# EAGLE schematic USB to RS232 (EAGLE 5.06)

## Sheet 1 of 3
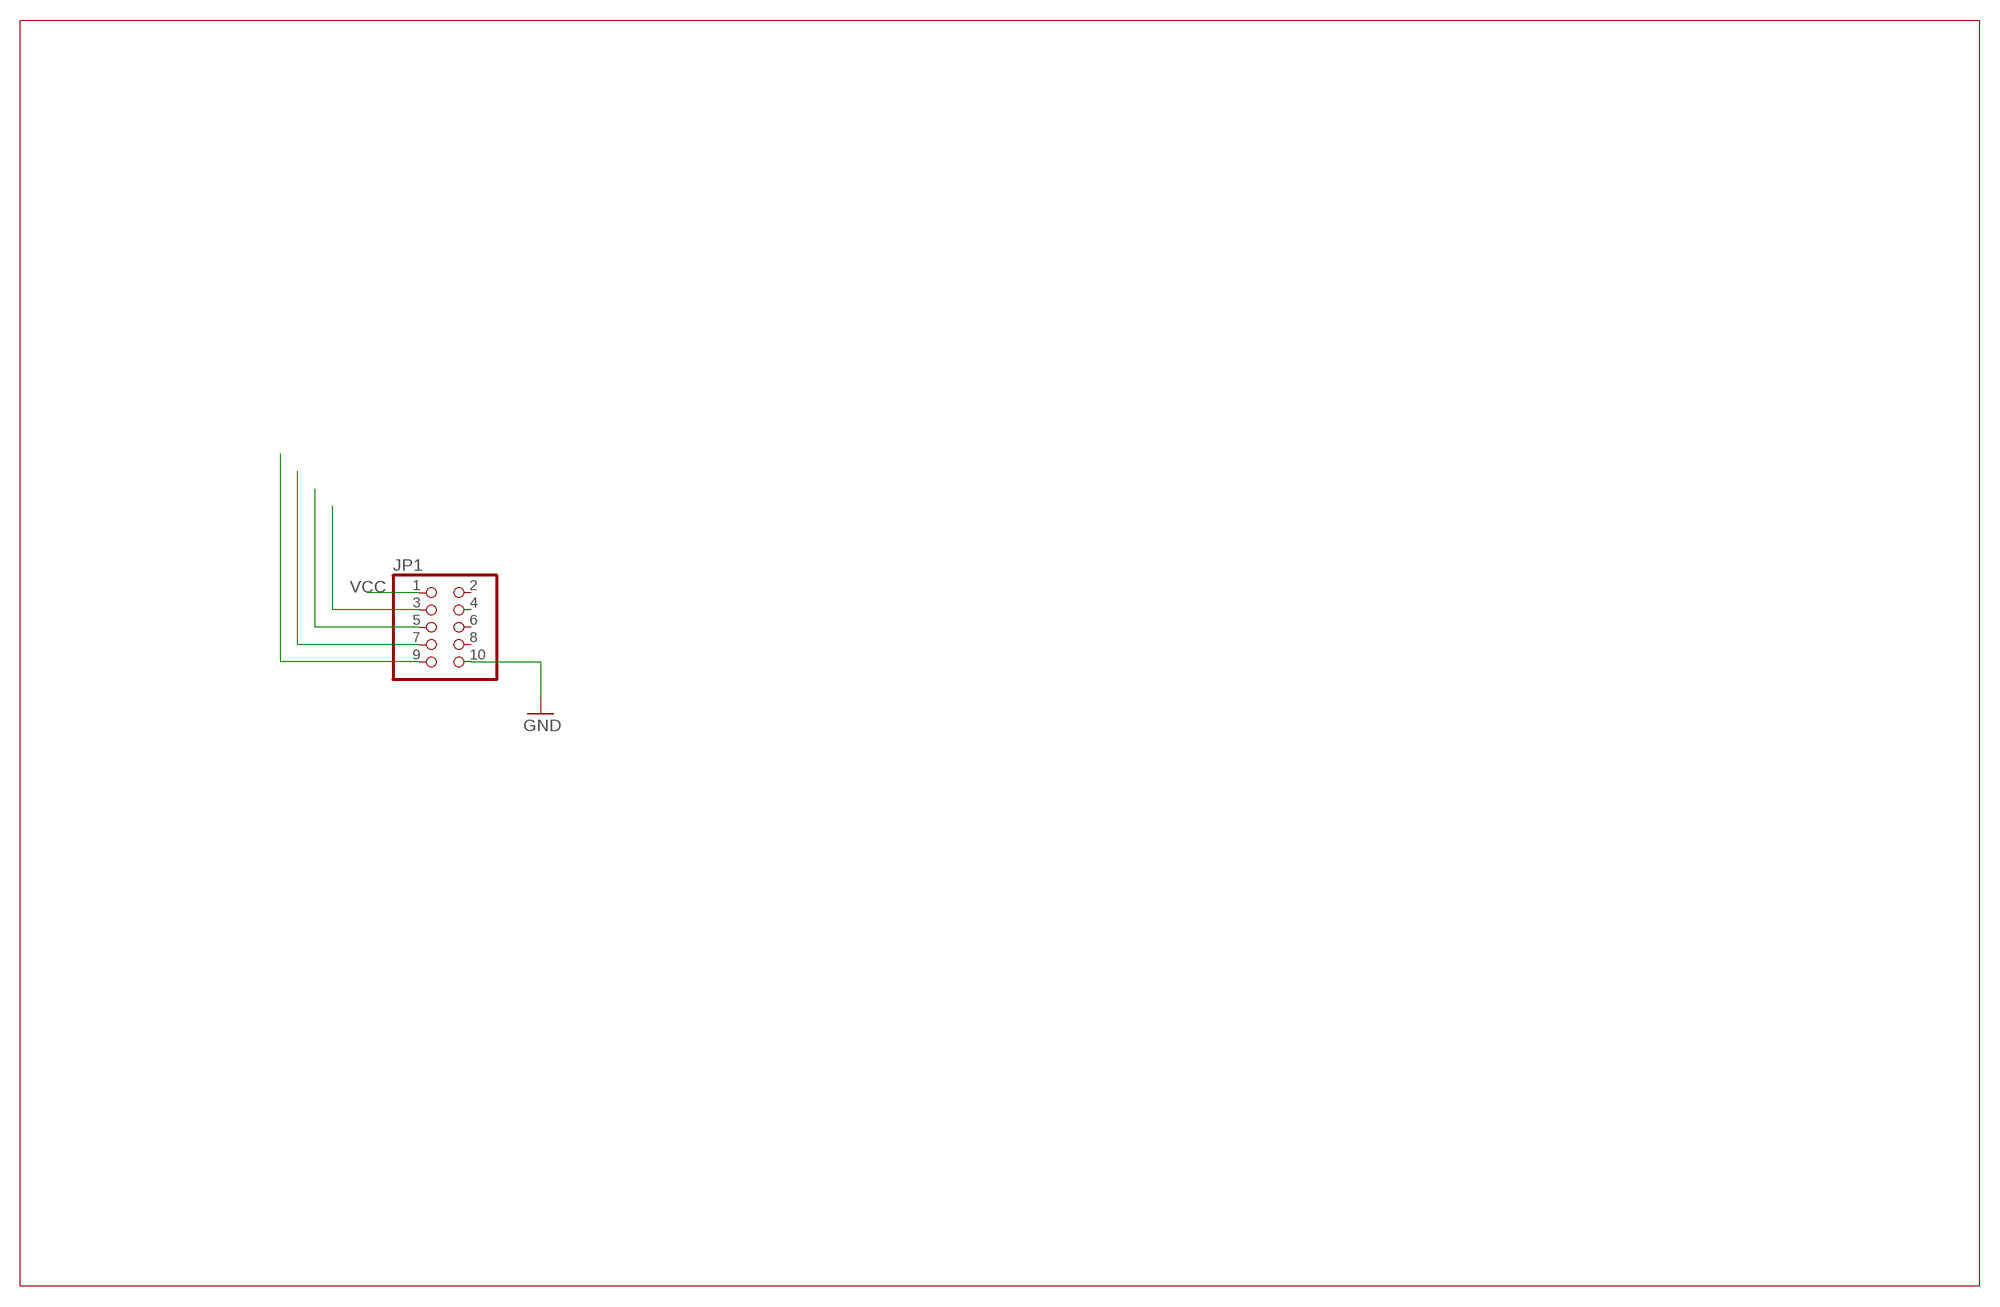
[diagram p0: schematic, sheet 1]

### Parts
JP1  PINHD-2X05_2.54-90°  [2X05/90]

### Nets
GND: JP1.10
N$1: JP1.3
N$2: JP1.5
N$3: JP1.7
N$4: JP1.9
VCC: JP1.1
Unconnected: JP1.2 JP1.4 JP1.6 JP1.8

## Sheet 2 of 3
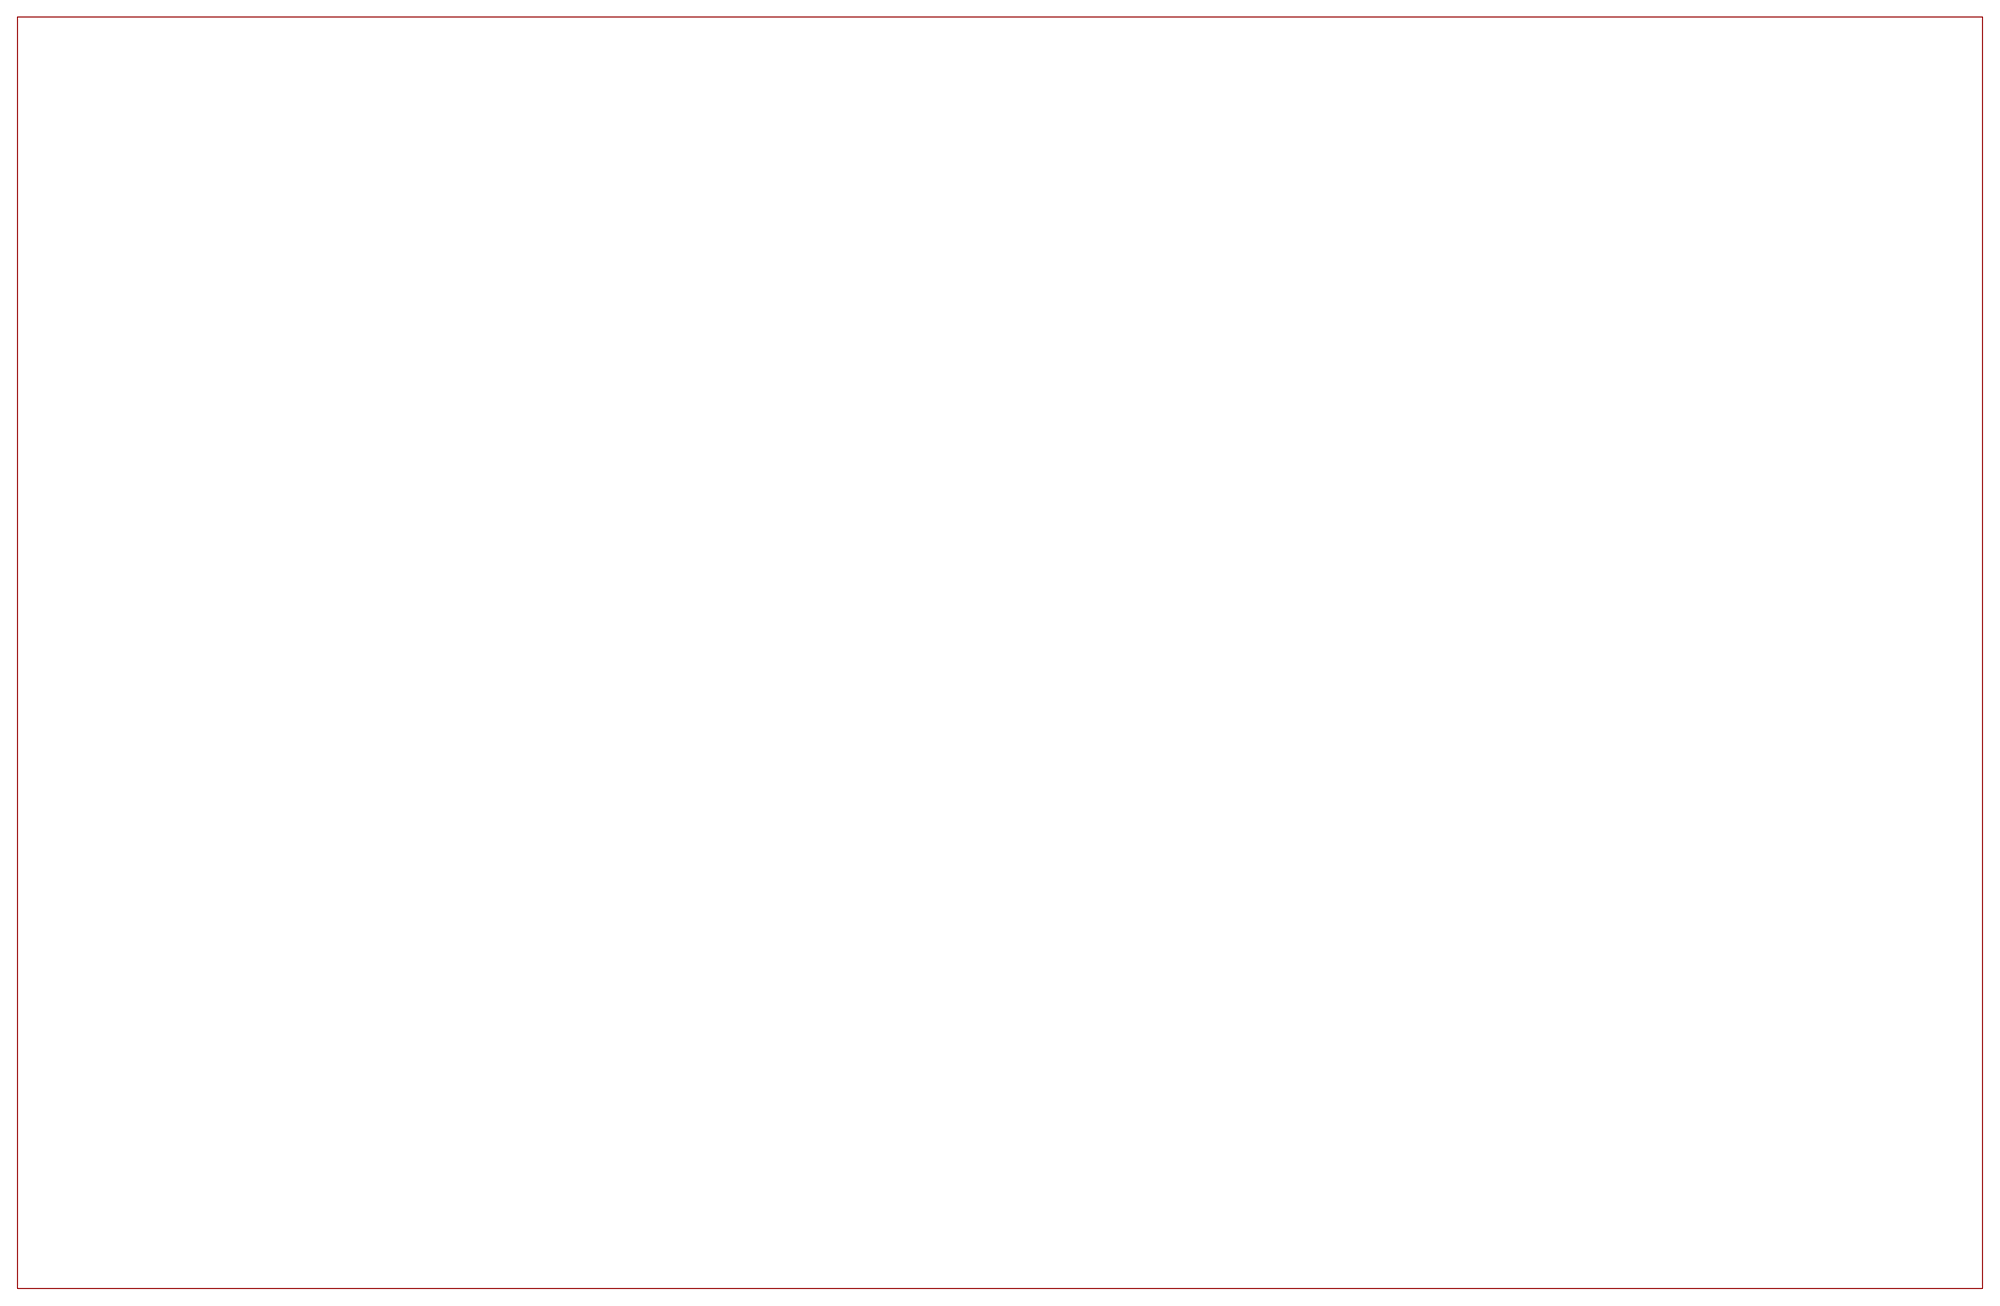
[diagram p1: schematic, sheet 2]

## Sheet 3 of 3
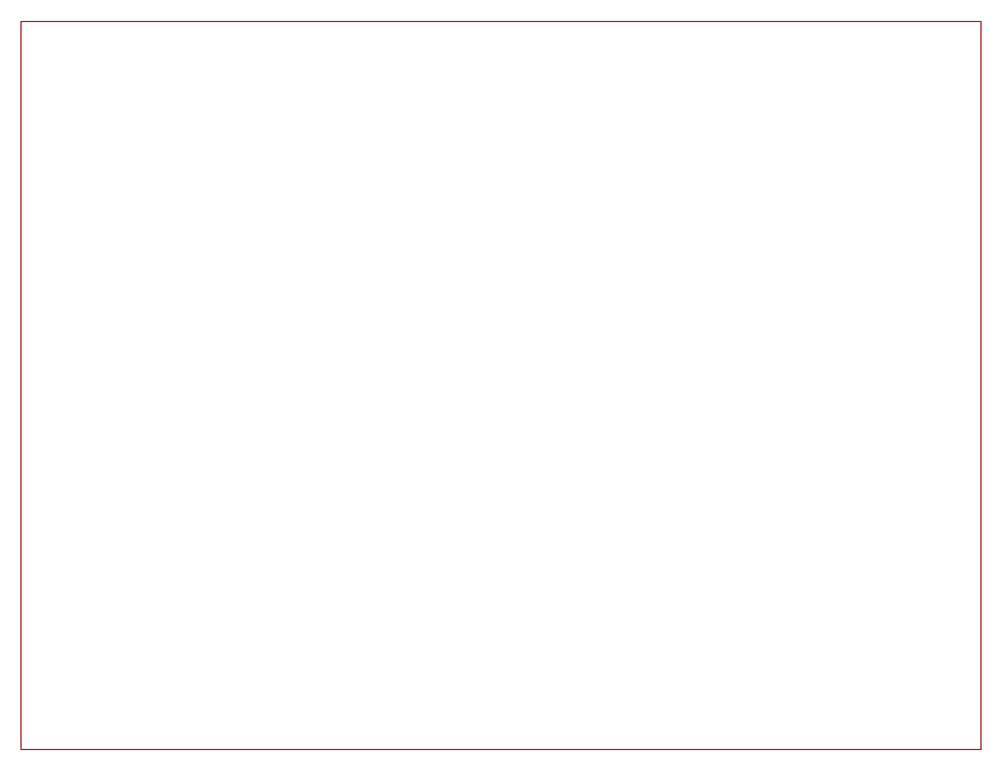
[diagram p2: schematic, sheet 3]

## Library data of the parts
JP1 = acon-tyco (19):PINHD-2X05: PIN HEADER